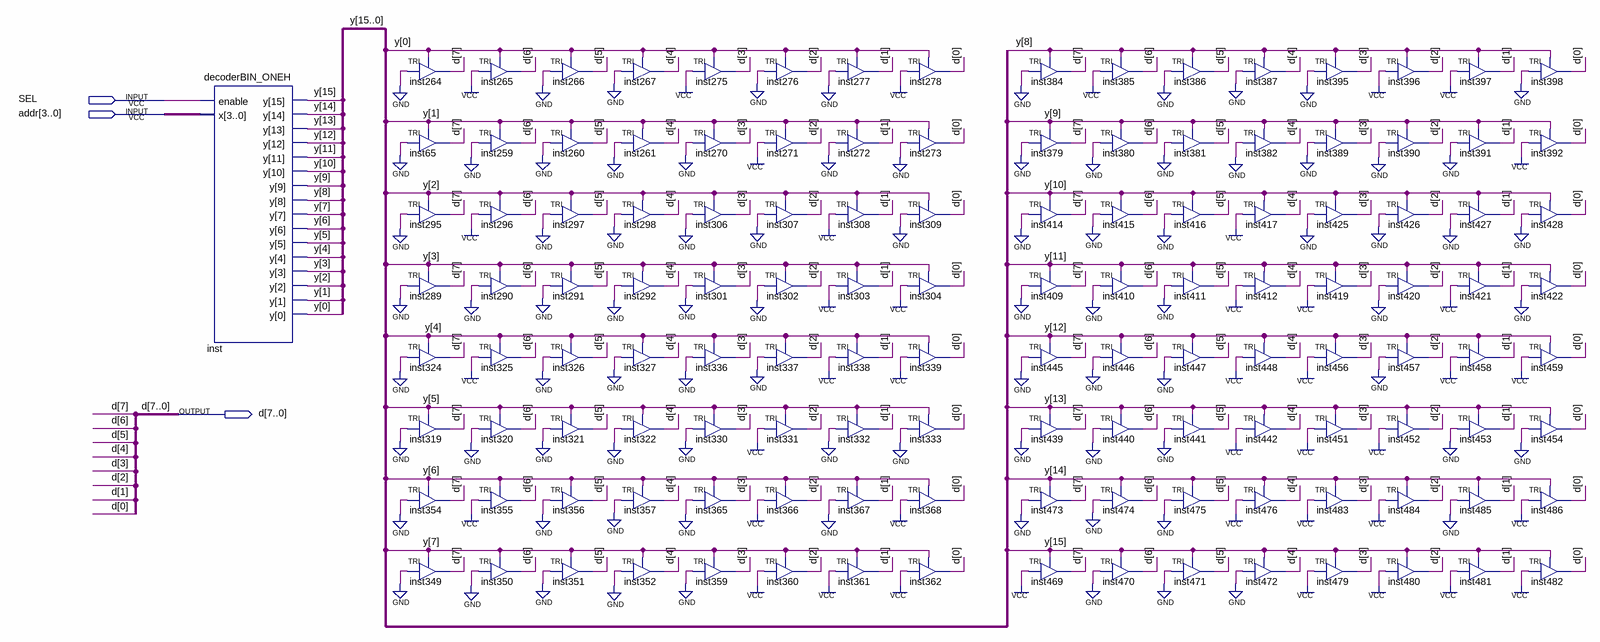
[diagram p0: schematic sheet]
// Quartus schematic rom16x8_11.bdf as structural Verilog: 129 symbols, 3 pins
module rom16x8_11 (
  input  SEL,
  input  [3:0] addr,
  output [7:0] d
);

  wire [15:0] y;

  decoderBIN_ONEH inst (.enable(SEL), .x(addr), .y(y));
  TRI inst264 (.IN(1'b0), .OE(y[0]), .OUT(d[7]));
  TRI inst65 (.IN(1'b0), .OE(y[1]), .OUT(d[7]));
  TRI inst295 (.IN(1'b0), .OE(y[2]), .OUT(d[7]));
  TRI inst289 (.IN(1'b0), .OE(y[3]), .OUT(d[7]));
  TRI inst324 (.IN(1'b0), .OE(y[4]), .OUT(d[7]));
  TRI inst319 (.IN(1'b0), .OE(y[5]), .OUT(d[7]));
  TRI inst354 (.IN(1'b0), .OE(y[6]), .OUT(d[7]));
  TRI inst349 (.IN(1'b0), .OE(y[7]), .OUT(d[7]));
  TRI inst265 (.IN(1'b1), .OE(y[0]), .OUT(d[6]));
  TRI inst259 (.IN(1'b0), .OE(y[1]), .OUT(d[6]));
  TRI inst296 (.IN(1'b1), .OE(y[2]), .OUT(d[6]));
  TRI inst290 (.IN(1'b0), .OE(y[3]), .OUT(d[6]));
  TRI inst325 (.IN(1'b1), .OE(y[4]), .OUT(d[6]));
  TRI inst320 (.IN(1'b0), .OE(y[5]), .OUT(d[6]));
  TRI inst355 (.IN(1'b1), .OE(y[6]), .OUT(d[6]));
  TRI inst350 (.IN(1'b0), .OE(y[7]), .OUT(d[6]));
  TRI inst266 (.IN(1'b0), .OE(y[0]), .OUT(d[5]));
  TRI inst260 (.IN(1'b0), .OE(y[1]), .OUT(d[5]));
  TRI inst297 (.IN(1'b0), .OE(y[2]), .OUT(d[5]));
  TRI inst291 (.IN(1'b0), .OE(y[3]), .OUT(d[5]));
  TRI inst326 (.IN(1'b0), .OE(y[4]), .OUT(d[5]));
  TRI inst321 (.IN(1'b0), .OE(y[5]), .OUT(d[5]));
  TRI inst356 (.IN(1'b0), .OE(y[6]), .OUT(d[5]));
  TRI inst351 (.IN(1'b0), .OE(y[7]), .OUT(d[5]));
  TRI inst267 (.IN(1'b0), .OE(y[0]), .OUT(d[4]));
  TRI inst261 (.IN(1'b0), .OE(y[1]), .OUT(d[4]));
  TRI inst298 (.IN(1'b0), .OE(y[2]), .OUT(d[4]));
  TRI inst292 (.IN(1'b0), .OE(y[3]), .OUT(d[4]));
  TRI inst327 (.IN(1'b0), .OE(y[4]), .OUT(d[4]));
  TRI inst322 (.IN(1'b0), .OE(y[5]), .OUT(d[4]));
  TRI inst357 (.IN(1'b0), .OE(y[6]), .OUT(d[4]));
  TRI inst352 (.IN(1'b0), .OE(y[7]), .OUT(d[4]));
  TRI inst275 (.IN(1'b1), .OE(y[0]), .OUT(d[3]));
  TRI inst270 (.IN(1'b0), .OE(y[1]), .OUT(d[3]));
  TRI inst306 (.IN(1'b0), .OE(y[2]), .OUT(d[3]));
  TRI inst301 (.IN(1'b0), .OE(y[3]), .OUT(d[3]));
  TRI inst336 (.IN(1'b0), .OE(y[4]), .OUT(d[3]));
  TRI inst330 (.IN(1'b0), .OE(y[5]), .OUT(d[3]));
  TRI inst365 (.IN(1'b0), .OE(y[6]), .OUT(d[3]));
  TRI inst359 (.IN(1'b0), .OE(y[7]), .OUT(d[3]));
  TRI inst276 (.IN(1'b0), .OE(y[0]), .OUT(d[2]));
  TRI inst271 (.IN(1'b1), .OE(y[1]), .OUT(d[2]));
  TRI inst307 (.IN(1'b0), .OE(y[2]), .OUT(d[2]));
  TRI inst302 (.IN(1'b0), .OE(y[3]), .OUT(d[2]));
  TRI inst337 (.IN(1'b0), .OE(y[4]), .OUT(d[2]));
  TRI inst331 (.IN(1'b1), .OE(y[5]), .OUT(d[2]));
  TRI inst366 (.IN(1'b1), .OE(y[6]), .OUT(d[2]));
  TRI inst360 (.IN(1'b1), .OE(y[7]), .OUT(d[2]));
  TRI inst277 (.IN(1'b0), .OE(y[0]), .OUT(d[1]));
  TRI inst272 (.IN(1'b0), .OE(y[1]), .OUT(d[1]));
  TRI inst308 (.IN(1'b1), .OE(y[2]), .OUT(d[1]));
  TRI inst303 (.IN(1'b1), .OE(y[3]), .OUT(d[1]));
  TRI inst338 (.IN(1'b1), .OE(y[4]), .OUT(d[1]));
  TRI inst332 (.IN(1'b0), .OE(y[5]), .OUT(d[1]));
  TRI inst367 (.IN(1'b0), .OE(y[6]), .OUT(d[1]));
  TRI inst361 (.IN(1'b1), .OE(y[7]), .OUT(d[1]));
  TRI inst278 (.IN(1'b1), .OE(y[0]), .OUT(d[0]));
  TRI inst273 (.IN(1'b0), .OE(y[1]), .OUT(d[0]));
  TRI inst309 (.IN(1'b0), .OE(y[2]), .OUT(d[0]));
  TRI inst304 (.IN(1'b1), .OE(y[3]), .OUT(d[0]));
  TRI inst339 (.IN(1'b1), .OE(y[4]), .OUT(d[0]));
  TRI inst333 (.IN(1'b0), .OE(y[5]), .OUT(d[0]));
  TRI inst368 (.IN(1'b1), .OE(y[6]), .OUT(d[0]));
  TRI inst362 (.IN(1'b1), .OE(y[7]), .OUT(d[0]));
  TRI inst384 (.IN(1'b0), .OE(y[8]), .OUT(d[7]));
  TRI inst379 (.IN(1'b0), .OE(y[9]), .OUT(d[7]));
  TRI inst414 (.IN(1'b0), .OE(y[10]), .OUT(d[7]));
  TRI inst409 (.IN(1'b0), .OE(y[11]), .OUT(d[7]));
  TRI inst445 (.IN(1'b0), .OE(y[12]), .OUT(d[7]));
  TRI inst439 (.IN(1'b0), .OE(y[13]), .OUT(d[7]));
  TRI inst473 (.IN(1'b0), .OE(y[14]), .OUT(d[7]));
  TRI inst469 (.IN(1'b1), .OE(y[15]), .OUT(d[7]));
  TRI inst385 (.IN(1'b1), .OE(y[8]), .OUT(d[6]));
  TRI inst380 (.IN(1'b0), .OE(y[9]), .OUT(d[6]));
  TRI inst415 (.IN(1'b0), .OE(y[10]), .OUT(d[6]));
  TRI inst410 (.IN(1'b0), .OE(y[11]), .OUT(d[6]));
  TRI inst446 (.IN(1'b0), .OE(y[12]), .OUT(d[6]));
  TRI inst440 (.IN(1'b0), .OE(y[13]), .OUT(d[6]));
  TRI inst474 (.IN(1'b0), .OE(y[14]), .OUT(d[6]));
  TRI inst470 (.IN(1'b0), .OE(y[15]), .OUT(d[6]));
  TRI inst386 (.IN(1'b0), .OE(y[8]), .OUT(d[5]));
  TRI inst381 (.IN(1'b0), .OE(y[9]), .OUT(d[5]));
  TRI inst416 (.IN(1'b0), .OE(y[10]), .OUT(d[5]));
  TRI inst411 (.IN(1'b0), .OE(y[11]), .OUT(d[5]));
  TRI inst447 (.IN(1'b0), .OE(y[12]), .OUT(d[5]));
  TRI inst441 (.IN(1'b0), .OE(y[13]), .OUT(d[5]));
  TRI inst475 (.IN(1'b0), .OE(y[14]), .OUT(d[5]));
  TRI inst471 (.IN(1'b0), .OE(y[15]), .OUT(d[5]));
  TRI inst387 (.IN(1'b0), .OE(y[8]), .OUT(d[4]));
  TRI inst382 (.IN(1'b0), .OE(y[9]), .OUT(d[4]));
  TRI inst417 (.IN(1'b1), .OE(y[10]), .OUT(d[4]));
  TRI inst412 (.IN(1'b1), .OE(y[11]), .OUT(d[4]));
  TRI inst448 (.IN(1'b1), .OE(y[12]), .OUT(d[4]));
  TRI inst442 (.IN(1'b1), .OE(y[13]), .OUT(d[4]));
  TRI inst476 (.IN(1'b1), .OE(y[14]), .OUT(d[4]));
  TRI inst472 (.IN(1'b0), .OE(y[15]), .OUT(d[4]));
  TRI inst395 (.IN(1'b0), .OE(y[8]), .OUT(d[3]));
  TRI inst389 (.IN(1'b0), .OE(y[9]), .OUT(d[3]));
  TRI inst425 (.IN(1'b0), .OE(y[10]), .OUT(d[3]));
  TRI inst419 (.IN(1'b1), .OE(y[11]), .OUT(d[3]));
  TRI inst456 (.IN(1'b1), .OE(y[12]), .OUT(d[3]));
  TRI inst451 (.IN(1'b1), .OE(y[13]), .OUT(d[3]));
  TRI inst483 (.IN(1'b1), .OE(y[14]), .OUT(d[3]));
  TRI inst479 (.IN(1'b1), .OE(y[15]), .OUT(d[3]));
  TRI inst396 (.IN(1'b1), .OE(y[8]), .OUT(d[2]));
  TRI inst390 (.IN(1'b0), .OE(y[9]), .OUT(d[2]));
  TRI inst426 (.IN(1'b0), .OE(y[10]), .OUT(d[2]));
  TRI inst420 (.IN(1'b0), .OE(y[11]), .OUT(d[2]));
  TRI inst457 (.IN(1'b0), .OE(y[12]), .OUT(d[2]));
  TRI inst452 (.IN(1'b1), .OE(y[13]), .OUT(d[2]));
  TRI inst484 (.IN(1'b1), .OE(y[14]), .OUT(d[2]));
  TRI inst480 (.IN(1'b1), .OE(y[15]), .OUT(d[2]));
  TRI inst397 (.IN(1'b1), .OE(y[8]), .OUT(d[1]));
  TRI inst391 (.IN(1'b0), .OE(y[9]), .OUT(d[1]));
  TRI inst427 (.IN(1'b0), .OE(y[10]), .OUT(d[1]));
  TRI inst421 (.IN(1'b1), .OE(y[11]), .OUT(d[1]));
  TRI inst458 (.IN(1'b1), .OE(y[12]), .OUT(d[1]));
  TRI inst453 (.IN(1'b0), .OE(y[13]), .OUT(d[1]));
  TRI inst485 (.IN(1'b0), .OE(y[14]), .OUT(d[1]));
  TRI inst481 (.IN(1'b1), .OE(y[15]), .OUT(d[1]));
  TRI inst398 (.IN(1'b0), .OE(y[8]), .OUT(d[0]));
  TRI inst392 (.IN(1'b1), .OE(y[9]), .OUT(d[0]));
  TRI inst428 (.IN(1'b0), .OE(y[10]), .OUT(d[0]));
  TRI inst422 (.IN(1'b0), .OE(y[11]), .OUT(d[0]));
  TRI inst459 (.IN(1'b1), .OE(y[12]), .OUT(d[0]));
  TRI inst454 (.IN(1'b0), .OE(y[13]), .OUT(d[0]));
  TRI inst486 (.IN(1'b1), .OE(y[14]), .OUT(d[0]));
  TRI inst482 (.IN(1'b1), .OE(y[15]), .OUT(d[0]));
endmodule
